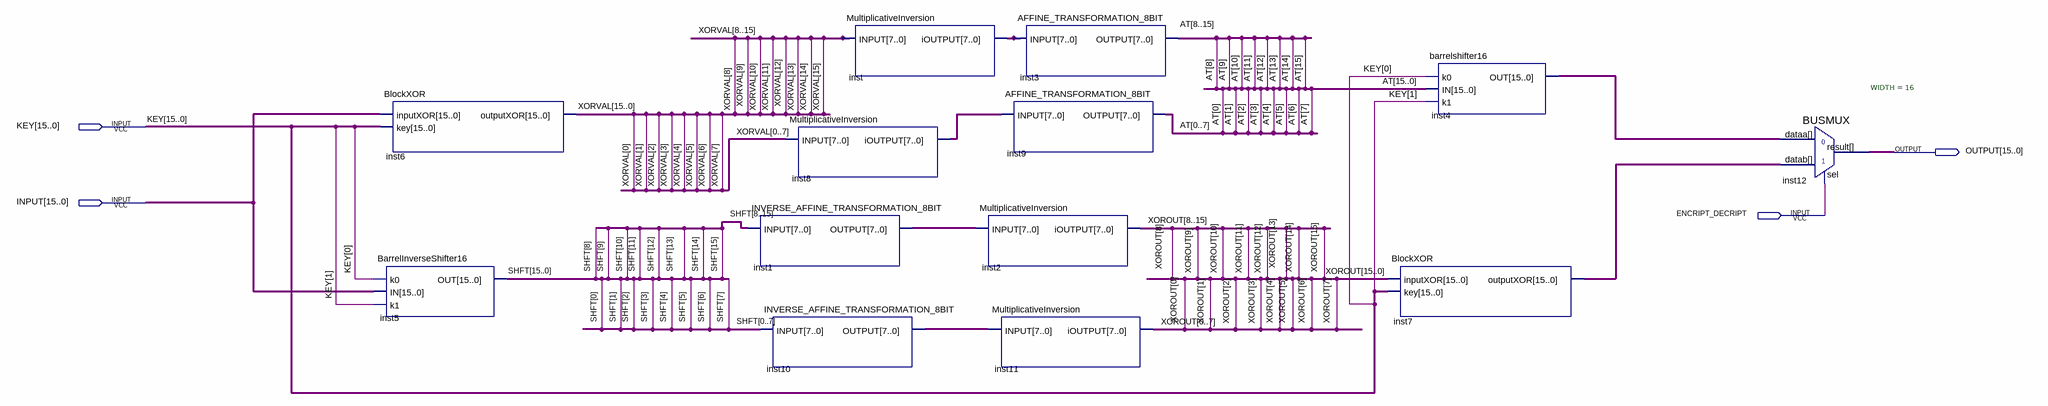
[diagram p0: schematic sheet]
// Quartus schematic ENCRIPTER_DECRIPTER.bdf as structural Verilog: 13 symbols, 4 pins
module ENCRIPTER_DECRIPTER (
  input  [15:0] KEY,
  input  [15:0] INPUT,
  input  ENCRIPT_DECRIPT,
  output [15:0] OUTPUT
);

  wire [7:0] inst1_output, inst8_ioutput, inst10_output, inst_ioutput;
  wire [15:0] AT, inst4_out, inst7_outputxor, SHFT, XOROUT, XORVAL;

  BlockXOR inst6 (.inputXOR(INPUT), .key(KEY), .outputXOR(XORVAL));
  BarrelInverseShifter16 inst5 (.k0(KEY[0]), .IN(INPUT), .k1(KEY[1]), .OUT(SHFT));
  MultiplicativeInversion inst8 (
    .INPUT({XORVAL[0], XORVAL[1], XORVAL[2], XORVAL[3], XORVAL[4], XORVAL[5], XORVAL[6], XORVAL[7]}),
    .iOUTPUT(inst8_ioutput));
  INVERSE_AFFINE_TRANSFORMATION_8BIT inst1 (
    .INPUT({SHFT[8], SHFT[9], SHFT[10], SHFT[11], SHFT[12], SHFT[13], SHFT[14], SHFT[15]}),
    .OUTPUT(inst1_output));
  INVERSE_AFFINE_TRANSFORMATION_8BIT inst10 (
    .INPUT({SHFT[0], SHFT[1], SHFT[2], SHFT[3], SHFT[4], SHFT[5], SHFT[6], SHFT[7]}), .OUTPUT(inst10_output));
  MultiplicativeInversion inst (
    .INPUT({XORVAL[8], XORVAL[9], XORVAL[10], XORVAL[11], XORVAL[12], XORVAL[13], XORVAL[14], XORVAL[15]}),
    .iOUTPUT(inst_ioutput));
  MultiplicativeInversion inst2 (
    .INPUT(inst1_output),
    .iOUTPUT({XOROUT[8], XOROUT[9], XOROUT[10], XOROUT[11], XOROUT[12], XOROUT[13], XOROUT[14], XOROUT[15]}));
  MultiplicativeInversion inst11 (
    .INPUT(inst10_output),
    .iOUTPUT({XOROUT[0], XOROUT[1], XOROUT[2], XOROUT[3], XOROUT[4], XOROUT[5], XOROUT[6], XOROUT[7]}));
  AFFINE_TRANSFORMATION_8BIT inst3 (
    .INPUT(inst_ioutput), .OUTPUT({AT[8], AT[9], AT[10], AT[11], AT[12], AT[13], AT[14], AT[15]}));
  AFFINE_TRANSFORMATION_8BIT inst9 (
    .INPUT(inst8_ioutput), .OUTPUT({AT[0], AT[1], AT[2], AT[3], AT[4], AT[5], AT[6], AT[7]}));
  BlockXOR inst7 (.inputXOR(XOROUT), .key(KEY), .outputXOR(inst7_outputxor));
  barrelshifter16 inst4 (.k0(KEY[0]), .IN(AT), .k1(KEY[1]), .OUT(inst4_out));
  BUSMUX #(.WIDTH(16)) inst12 (.datab(inst7_outputxor), .sel(ENCRIPT_DECRIPT), .dataa(inst4_out), .result(OUTPUT));
endmodule
